# Altium schematic sheet EMG Amplifier.SchDoc
size A4; Organization: Altium Limited; Address1: 3 Minna Close; Address2: Belrose; Address3: NSW 2085; Address4: Australia
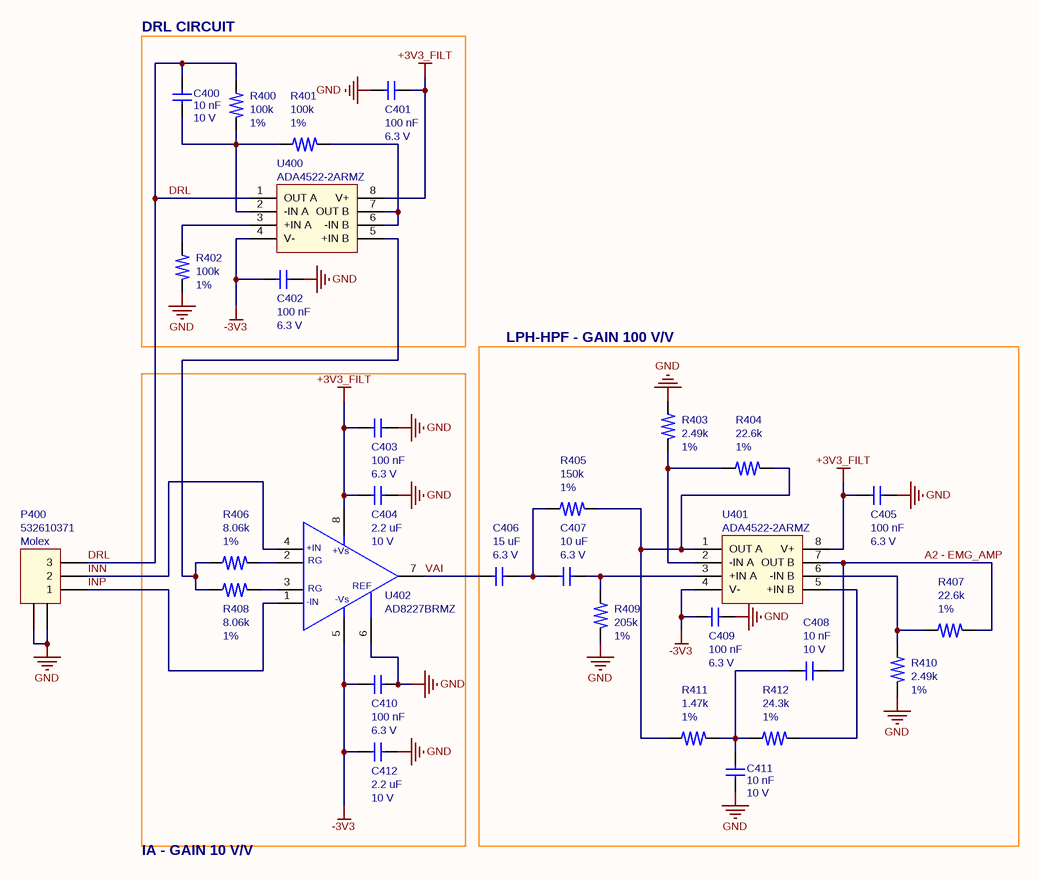
[diagram p0: EMG Amplifier.SchDoc]

## Parts
C400  value 10 nF  Voltage Max: 10 V  [C0201]  (hidden comment: Capacitor no polarized)
C401  value 100 nF  Voltage Max: 6.3 V  [C0201]  (hidden comment: Capacitor no polarized)
C402  value 100 nF  Voltage Max: 6.3 V  [C0201]  (hidden comment: Capacitor no polarized)
C403  value 100 nF  Voltage Max: 6.3 V  [C0201]  (hidden comment: Capacitor no polarized)
C404  value 2.2 uF  Voltage Max: 10 V  [C0201]  (hidden comment: Capacitor no polarized)
C405  value 100 nF  Voltage Max: 6.3 V  [C0201]  (hidden comment: Capacitor no polarized)
C406  value 15 uF  Voltage Max: 6.3 V  [C0402]  (hidden comment: Capacitor no polarized)
C407  value 10 uF  Voltage Max: 6.3 V  [C0402]  (hidden comment: Capacitor no polarized)
C408  value 10 nF  Voltage Max: 10 V  [C0201]  (hidden comment: Capacitor no polarized)
C409  value 100 nF  Voltage Max: 6.3 V  [C0201]  (hidden comment: Capacitor no polarized)
C410  value 100 nF  Voltage Max: 6.3 V  [C0201]  (hidden comment: Capacitor no polarized)
C411  value 10 nF  Voltage Max: 10 V  [C0201]  (hidden comment: Capacitor no polarized)
C412  value 2.2 uF  Voltage Max: 10 V  [C0201]  (hidden comment: Capacitor no polarized)
P400  Manufacturer: Molex  [532610371]  (hidden comment: 532610371)
R400  value 100k  Tolerance: 1%  [R0201]  (hidden comment: R)
R401  value 100k  Tolerance: 1%  [R0201]  (hidden comment: R)
R402  value 100k  Tolerance: 1%  [R0201]  (hidden comment: R)
R403  value 2.49k  Tolerance: 1%  [R0201]  (hidden comment: R)
R404  value 22.6k  Tolerance: 1%  [R0201]  (hidden comment: R)
R405  value 150k  Tolerance: 1%  [R0201]  (hidden comment: R)
R406  value 8.06k  Tolerance: 1%  [R0201]  (hidden comment: R)
R407  value 22.6k  Tolerance: 1%  [R0201]  (hidden comment: R)
R408  value 8.06k  Tolerance: 1%  [R0201]  (hidden comment: R)
R409  value 205k  Tolerance: 1%  [R0201]  (hidden comment: R)
R410  value 2.49k  Tolerance: 1%  [R0201]  (hidden comment: R)
R411  value 1.47k  Tolerance: 1%  [R0201]  (hidden comment: R)
R412  value 24.3k  Tolerance: 1%  [R0201]  (hidden comment: R)
U400  ADA4522-2ARMZ  [8-MSOP]
U401  ADA4522-2ARMZ  [8-MSOP]
U402  AD8227BRMZ  [8-MSOP]

## Blocks framed on the sheet
DRL CIRCUIT: C400-C402 R400-R402 U400
LPH-HPF - GAIN 100 V/V: C405-C409 C411 R403-R405 R407 R409-R412 U401

## Nets
+3V3_FILT: C401.2 C403.2 C404.2 C405.2 U400.8(V+) U401.8(V+) U402.8(+Vs)
-3V3: C402.2 C409.2 C410.2 C412.2 U400.4(V-) U401.4(V-) U402.5(-Vs)
GND: C401.1 C402.1 C403.1 C404.1 C405.1 C409.1 C410.1 C411.1 C412.1 P400.0 R402.2 R403.1 R409.2 R410.2 U402.6(REF)
A2 - EMG_AMP: C408.2 R407.2 U401.7(OUT_B)
DRL: C400.2 P400.3 R400.1 U400.1(OUT_A)
INN: P400.2 U402.4(+IN)
INP: P400.1 U402.1(+IN)
VAI: C406.2 U402.7(OUT)
NetC400_1: C400.1 R400.2 R401.1 U400.2(-IN_A)
NetC406_1: C406.1 C407.2 R405.1
NetC407_1: C407.1 R409.1 U401.3(+IN_A)
NetC408_1: C408.1 C411.2 R411.2 R412.1
NetR401_2: R401.2 U400.6(-IN_B) U400.7(OUT_B)
NetR402_1: R402.1 U400.3(+IN_A)
NetR403_2: R403.2 R404.1 U401.2(-IN_A)
NetR404_2: R404.2 R405.2 R411.1 U401.1(OUT_A)
NetR406_1: R406.1 R408.1 U400.5(+IN_B)
NetR406_2: R406.2 U402.2(RG)
NetR407_1: R407.1 R410.1 U401.6(-IN_B)
NetR408_2: R408.2 U402.3(RG)
NetR412_2: R412.2 U401.5(+IN_B)

## Notes on the sheet
- IA - GAIN 10 V/V
- Title
- Size:
- Date:
- A4
- Number:
- Time:
- Revision:
- Sheet
- of
- File:
- (in symbol AD8227BRMZ) -IN

## Library data of the parts
C400 C408 C411 = Capacitor no polarized: Generic Capacitor; Manufacturer: Murata; Dielectric: X7R; Tolerance: 10%; Reference: GRM033R71A103KA01D; Component URL: https://www.murata.com/en-eu/products/productdetail?partno=GRM033R71A103KA01%23; Current Max: *; Package: 0201; Package Description: *; Power Max: *; Supplier 1: Mouser; Supplier 2: Farnell; Supplier 3: Digikey; Supplier 1 Part Number: 81-GRM033R71A103KA1D; Supplier 2 Part Number: 1776000; Supplier 3 Part Number: 490-3194-1-ND; ESR: *; Voltage Min: *; Voltage Typ: *
C401-C403 C405 C409 C410 = Capacitor no polarized: Generic Capacitor; Manufacturer: Murata; Dielectric: X5R; Tolerance: 10%; Reference: GMD033R60J104KE11D; Component URL: https://product.tdk.com/en/search/capacitor/ceramic/mlcc/info?part_no=C1608X5R0J156M080AC; Current Max: *; Package: 0201; Package Description: *; Power Max: *; Supplier 1: Mouser; Supplier 2: Farnell; Supplier 3: Digikey; Supplier 1 Part Number: 81-GMD033R60J104KE1D; Supplier 2 Part Number: 1657913; Supplier 3 Part Number: 490-14513-1-ND; ESR: *; Voltage Min: *; Voltage Typ: *
C404 C412 = Capacitor no polarized: Generic Capacitor; Manufacturer: Murata; Dielectric: X5R; Tolerance: 10%; Reference: GRM033R61A225KE47D; Component URL: https://product.tdk.com/en/search/capacitor/ceramic/mlcc/info?part_no=C1608X5R0J156M080AC; Current Max: *; Package: 0201; Package Description: *; Power Max: *; Supplier 1: Mouser; Supplier 2: Farnell; Supplier 3: Digikey; Supplier 1 Part Number: 81-GRM033R61A225KE7D; Supplier 2 Part Number: 3581639; Supplier 3 Part Number: 490-13227-1-ND; ESR: *; Voltage Min: *; Voltage Typ: *
C406 = Capacitor no polarized: Generic Capacitor; Manufacturer: Murata; Dielectric: X5R; Tolerance: 20%; Reference: GRM155R60J156ME05D; Component URL: https://www.murata.com/en-eu/products/productdetail?partno=GRM155R60J156ME05%23; Current Max: *; Package: 0402; Package Description: *; Power Max: *; Supplier 1: Mouser; Supplier 2: Farnell; Supplier 3: Digikey; Supplier 1 Part Number: 81-GRM155R60J156ME5D; Supplier 2 Part Number: 3581354; Supplier 3 Part Number: 490-18659-1-ND; ESR: *; Voltage Min: *; Voltage Typ: *
C407 = Capacitor no polarized: Generic Capacitor; Manufacturer: Murata; Dielectric: X5R; Tolerance: 20%; Reference: GRJ155R60J106ME11D; Component URL: https://www.murata.com/en-eu/products/productdetail?partno=GRJ155R60J106ME11%23; Current Max: *; Package: 0402; Package Description: *; Power Max: *; Supplier 1: Mouser; Supplier 2: Farnell; Supplier 3: Digikey; Supplier 1 Part Number: 81-GRJ155R60J106ME1D; Supplier 2 Part Number: 3581611; Supplier 3 Part Number: 490-13211-1-ND; ESR: *; Voltage Min: *; Voltage Typ: *
P400 = 532610371: 1.25mm Pitch, PicoBlade PCB Header, Single Row, Right-Angle, Surface Mount, Tin (Sn) Plating, Friction Lock, 3 Circuits, Tape and Reel; Voltage Max: 125 V; Component URL: https://www.molex.com/molex/products/part-detail/pcb_headers/0532610371; Footprint: *; Footprint Description: *; Power Max: *; Supplier 1: Mouser; Supplier 2: Farnell; Supplier 3: Digikey; Supplier 1 Part Number: 538-53261-0371; Supplier 2 Part Number: 1125359; Supplier 3 Part Number: WM7621CT-ND; Tolerance: *; Value: *; Voltage Min: *; Voltage Typ: *; Reference: 532610371
R400-R402 = R: Generic Resistor; Manufacturer: VISHAY/DALE; Power Max: 0.0050 W; Reference: CRCW0201100KFKED; Voltage Max: 30 V; Component URL: *; Current Max: *; Dielectric: *; Package: 0201; Package Description: *; Supplier 1: Mouser; Supplier 2: Farnell; Supplier 3: Digikey; Supplier 1 Part Number: 71-CRCW0201100KFKED; Supplier 2 Part Number: 2616720; Supplier 3 Part Number: 541-100KAABCT-ND; Voltage Min: *; Voltage Typ: *; ESR: *
R403 R410 = R: Generic Resistor; Manufacturer: VISHAY/DALE; Power Max: 0.050 W; Reference: CRCW02012K49FKED; Voltage Max: 30 V; Component URL: *; Current Max: *; Dielectric: *; Package: 0201; Package Description: *; Supplier 1: Mouser; Supplier 2: Farnell; Supplier 3: Digikey; Supplier 1 Part Number: 71-CRCW02012K49FKED; Supplier 2 Part Number: 2838900; Supplier 3 Part Number: 541-2.49KAABCT-ND; Voltage Min: *; Voltage Typ: *; ESR: *
R404 R407 = R: Generic Resistor; Manufacturer: VISHAY/DALE; Power Max: 0.050 W; Reference: CRCW020122K6FKED; Voltage Max: 30 V; Component URL: *; Current Max: *; Dielectric: *; Package: 0201; Package Description: *; Supplier 1: Mouser; Supplier 2: Farnell; Supplier 3: Digikey; Supplier 1 Part Number: 71-CRCW020122K6FKED; Supplier 3 Part Number: 541-22.6KAABCT-ND; Voltage Min: *; Voltage Typ: *; ESR: *
R405 = R: Generic Resistor; Manufacturer: VISHAY/DALE; Power Max: 0.050 W; Reference: CRCW0201150KFKED; Voltage Max: 30 V; Component URL: *; Current Max: *; Dielectric: *; Package: 0201; Package Description: *; Supplier 1: Mouser; Supplier 2: Farnell; Supplier 3: Digikey; Supplier 1 Part Number: 71-CRCW0201150KFKED; Supplier 2 Part Number: 2302394; Supplier 3 Part Number: 541-2943-1-ND; Voltage Min: *; Voltage Typ: *; ESR: *
R406 R408 = R: Generic Resistor; Manufacturer: VISHAY/DALE; Power Max: 0.050 W; Reference: CRCW02018K06FNED; Voltage Max: 30 V; Component URL: *; Current Max: *; Dielectric: *; Package: 0201; Package Description: *; Supplier 1: Mouser; Supplier 2: Farnell; Supplier 3: Digikey; Supplier 1 Part Number: 71-CRCW02018K06FNED; Supplier 2 Part Number: 1851382; Supplier 3 Part Number: 541-CRCW02018K06FNEDCT-ND; Voltage Min: *; Voltage Typ: *; ESR: *
R409 = R: Generic Resistor; Manufacturer: VISHAY/DALE; Power Max: 0.050 W; Reference: CRCW0201205KFKED; Voltage Max: 30 V; Component URL: *; Current Max: *; Dielectric: *; Package: 0201; Package Description: *; Supplier 1: Mouser; Supplier 2: Farnell; Supplier 3: Digikey; Supplier 1 Part Number: 71-CRCW0201205KFKED; Supplier 2 Part Number: 1851000; Supplier 3 Part Number: CRCW0201205KFKED-ND; Voltage Min: *; Voltage Typ: *; ESR: *
R411 = R: Generic Resistor; Manufacturer: VISHAY/DALE; Power Max: 0.050 W; Reference: CRCW02011K47FKED; Voltage Max: 30 V; Component URL: *; Current Max: *; Dielectric: *; Package: 0201; Package Description: *; Supplier 1: Mouser; Supplier 2: Farnell; Supplier 3: Digikey; Supplier 1 Part Number: 71-CRCW02011K47FKED; Supplier 3 Part Number: 541-1.47KAABCT-ND; Voltage Min: *; Voltage Typ: *; ESR: *
R412 = R: Generic Resistor; Manufacturer: VISHAY/DALE; Power Max: 0.050 W; Reference: CRCW020124K3FKED; Voltage Max: 30 V; Component URL: *; Current Max: *; Dielectric: *; Package: 0201; Package Description: *; Supplier 1: Mouser; Supplier 2: Farnell; Supplier 3: Digikey; Supplier 1 Part Number: 71-CRCW020124K3FKED; Supplier 3 Part Number: CRCW020124K3FKED-ND; Voltage Min: *; Voltage Typ: *; ESR: *
U400 U401 = ADA4522-2ARMZ: Dual 55V, EMI Enhanced, Zero Drift, Ultralow Noise, Rail-to-Rail Output Operational Amplifiers; Manufacturer: Analog Devices; Current Max: 0.0009 A; Voltage Max: 55.0 V; Voltage Min: 4.5 V; Component URL: https://www.analog.com/en/products/ada4522-2.html; Dielectric: *; ESR: *; Package: 8-MSOP; Package Description: 8 Lead MSOP; Supplier 1: Mouser; Supplier 2: Farnell; Supplier 3: Digikey; Supplier 1 Part Number: 584-ADA4522-2ARMZ; Supplier 2 Part Number: 2725070; Supplier 3 Part Number: ADA4522-2ARMZ-ND; Tolerance: *; Value: *; Voltage Typ: *; Reference: ADA4522-2ARMZ
U402 = AD8227BRMZ: Wide Supply Range, Rail-to-Rail  Output Instrumentation Amplifier; Manufacturer: Analog Devices; Current Max: 0.6 mA; Voltage Max: 36.0 V; Voltage Min: 2.2 V; Component URL: https://www.analog.com/media/en/technical-documentation/data-sheets/AD8227.pdf; ESR: *; Footprint Description: *; Power Max: *; Supplier 1: Mouser; Supplier 2: Farnell; Supplier 3: Digikey; Supplier 1 Part Number: 584-AD8227BRMZ; Supplier 2 Part Number: 2462028; Supplier 3 Part Number: AD8227BRMZ-ND; Tolerance: *; Value: *; Voltage Typ: *; Reference: AD8227BRMZ